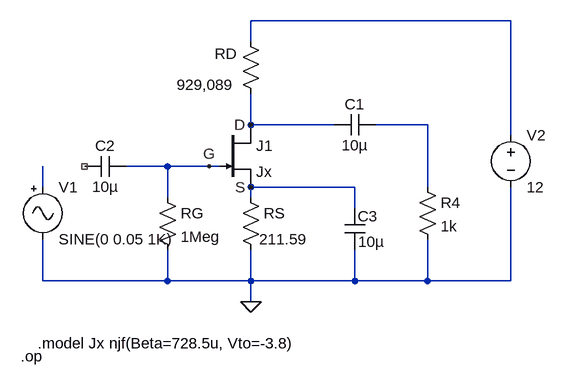
[diagram p0: schematic Draft1.asc]
Draft1.asc, the LTspice schematic file:
Version 4
SHEET 1 880 680
WIRE 544 -48 144 -48
WIRE 144 -16 144 -48
WIRE 144 112 144 64
WIRE 272 112 144 112
WIRE 416 112 336 112
WIRE 544 128 544 -48
WIRE 16 176 -48 176
WIRE 80 176 16 176
WIRE 96 176 80 176
WIRE -176 208 -176 176
WIRE 304 208 144 208
WIRE 416 208 416 112
WIRE 16 224 16 176
WIRE 144 224 144 208
WIRE 304 240 304 208
WIRE -176 352 -176 288
WIRE 16 352 16 304
WIRE 16 352 -176 352
WIRE 144 352 144 304
WIRE 144 352 16 352
WIRE 304 352 304 304
WIRE 304 352 144 352
WIRE 416 352 416 288
WIRE 416 352 304 352
WIRE 544 352 544 208
WIRE 544 352 416 352
WIRE 144 384 144 352
FLAG 144 384 0
FLAG 144 112 D
FLAG 144 208 S
FLAG 80 176 G
DATAFLAG 192 112 "$-V(S)"
DATAFLAG 64 176 "$-V(S)"
SYMBOL njf 96 112 R0
SYMATTR InstName J1
SYMATTR Value Jx
SYMBOL res 128 -32 R0
WINDOW 0 -40 35 Left 2
WINDOW 3 -98 82 Left 2
SYMATTR InstName RD
SYMATTR Value 929,089
SYMBOL res 128 208 R0
WINDOW 3 29 80 Left 2
SYMATTR InstName RS
SYMATTR Value 211.59
SYMBOL res 0 208 R0
SYMATTR InstName RG
SYMATTR Value 1Meg
SYMBOL res 400 192 R0
SYMATTR InstName R4
SYMATTR Value 1k
SYMBOL cap 336 96 R90
WINDOW 0 0 32 VBottom 2
WINDOW 3 32 32 VTop 2
SYMATTR InstName C1
SYMATTR Value 10µ
SYMBOL cap -48 160 R90
WINDOW 0 0 32 VBottom 2
WINDOW 3 32 32 VTop 2
SYMATTR InstName C2
SYMATTR Value 10µ
SYMBOL Misc\\signal -176 192 R0
WINDOW 123 0 0 Left 0
WINDOW 39 0 0 Left 0
SYMATTR InstName V1
SYMATTR Value SINE(0 0.05 1K)
SYMBOL voltage 544 112 R0
WINDOW 123 0 0 Left 0
WINDOW 39 0 0 Left 0
SYMATTR InstName V2
SYMATTR Value 12
SYMBOL cap 320 304 R180
WINDOW 0 -19 51 Left 2
WINDOW 3 -30 12 Left 2
SYMATTR InstName C3
SYMATTR Value 10µ
TEXT -184 448 Left 2 !.model Jx njf(Beta=728.5u, Vto=-3.8)
TEXT -210 468 Left 2 !.op

The netlist it stands for:
* Draft1.asc
J1 D G S Jx
RD N001 D 929,089
RS S 0 211.59
RG G 0 1Meg
R4 N002 0 1k
C1 N002 D 10µ
C2 G NC_01 10µ
V1 N003 0 SINE(0 0.05 1K)
V2 N001 0 12
C3 0 S 10µ
.model NJF NJF
.model PJF PJF
.lib standard.jft
.model Jx njf(Beta=728.5u, Vto=-3.8)
.op
.backanno
.end